# EAGLE design 4-UniverseOut (EAGLE 6.4)
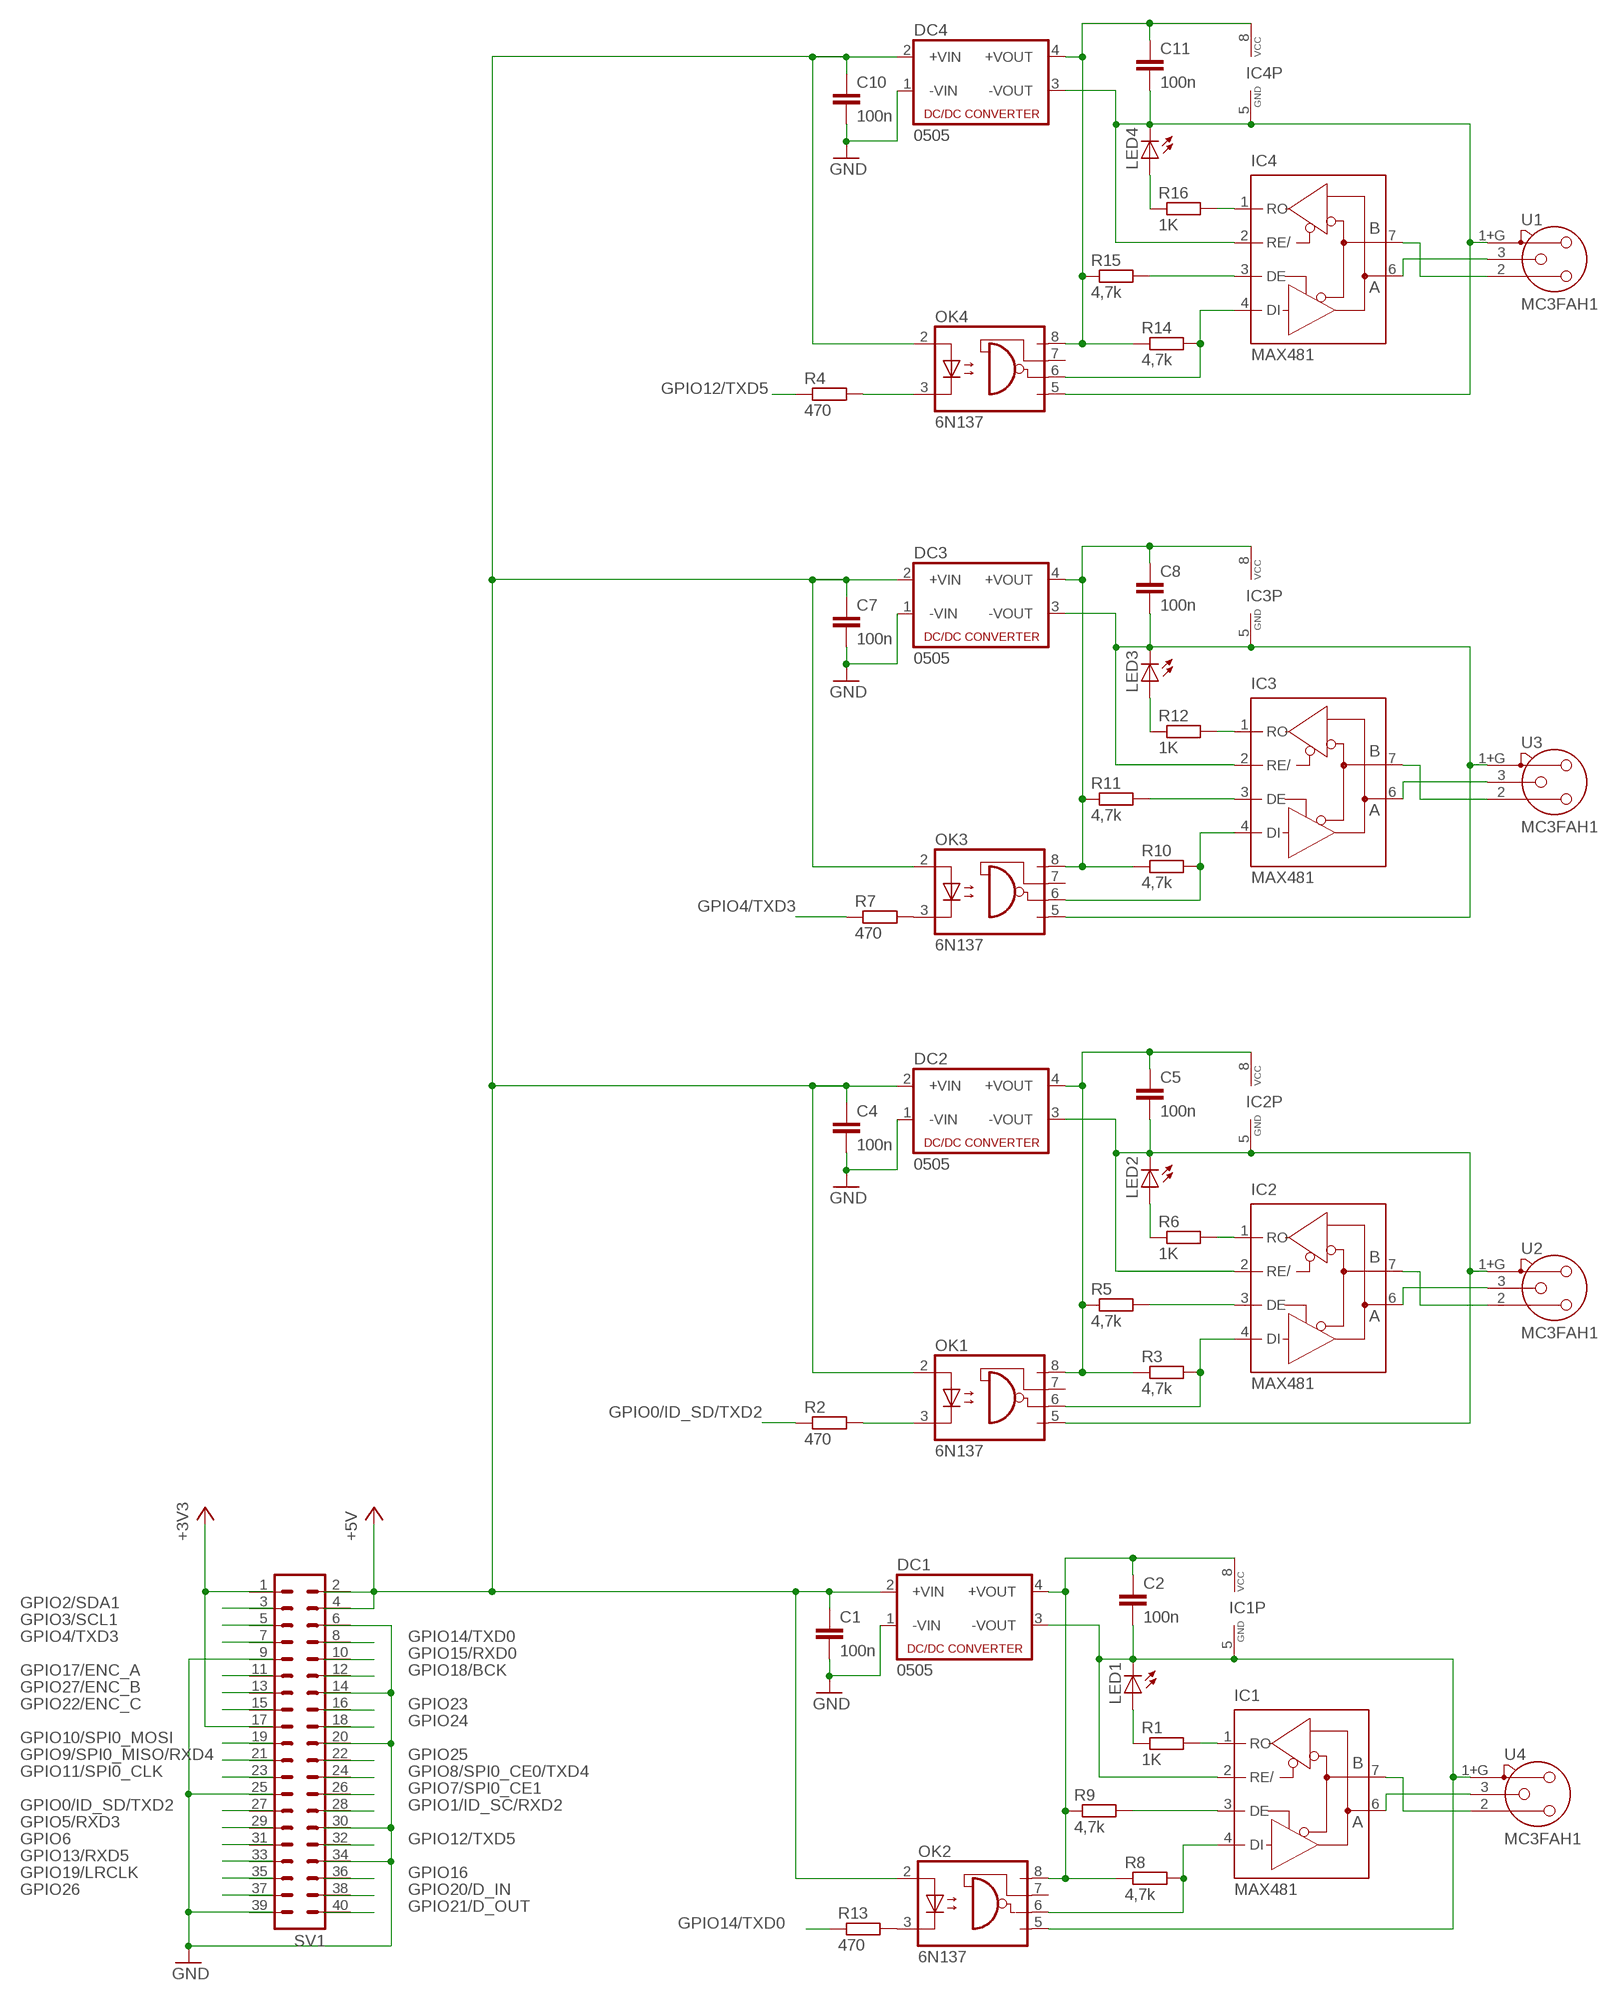
[diagram p0: schematic, sheet 1]

## Parts
C1  100n  C5/3  [C5B3]
C2  100n  C7.5/3  [C7.5B3]
C4  100n  C5/3  [C5B3]
C5  100n  C7.5/3  [C7.5B3]
C7  100n  C5/3  [C5B3]
C8  100n  C7.5/3  [C7.5B3]
C10  100n  C5/3  [C5B3]
C11  100n  C7.5/3  [C7.5B3]
DC1  0505  NME  [NME]
DC2  0505  NME  [NME]
DC3  0505  NME  [NME]
DC4  0505  NME  [NME]
IC1  MAX481  MAX481CPA  [DIL08]
IC2  MAX481  MAX481CPA  [DIL08]
IC3  MAX481  MAX481CPA  [DIL08]
IC4  MAX481  MAX481CPA  [DIL08]
LED1  LED3MM  [LED3MM]
LED2  LED3MM  [LED3MM]
LED3  LED3MM  [LED3MM]
LED4  LED3MM  [LED3MM]
OK1  6N137  [DIL08]
OK2  6N137  [DIL08]
OK3  6N137  [DIL08]
OK4  6N137  [DIL08]
R1  1K  R-EU_0204/7  [0204/7]
R2  470  R-EU_0207/12  [0207/12]
R3  4,7k  R-EU_0204/7  [0204/7]
R4  470  R-EU_0204/7  [0204/7]
R5  4,7k  R-EU_0204/7  [0204/7]
R6  1K  R-EU_0204/7  [0204/7]
R7  470  R-EU_0204/7  [0204/7]
R8  4,7k  R-EU_0204/7  [0204/7]
R9  4,7k  R-EU_0204/7  [0204/7]
R10  4,7k  R-EU_0204/7  [0204/7]
R11  4,7k  R-EU_0204/7  [0204/7]
R12  1K  R-EU_0204/7  [0204/7]
R13  470  R-EU_0204/7  [0204/7]
R14  4,7k  R-EU_0204/7  [0204/7]
R15  4,7k  R-EU_0204/7  [0204/7]
R16  1K  R-EU_0204/7  [0204/7]
SV1  ML40  [ML40]
U1  MC3FAH1  [NC3FAH1]
U2  MC3FAH1  [NC3FAH1]
U3  MC3FAH1  [NC3FAH1]
U4  MC3FAH1  [NC3FAH1]

## Nets
+3V3: SV1.1 SV1.17
+5V: C1.1 C4.1 C7.1 C10.1 DC1.2(+VIN) DC2.2(+VIN) DC3.2(+VIN) DC4.2(+VIN) OK1.2(A) OK2.2(A) OK3.2(A) OK4.2(A) SV1.2 SV1.4
+5V_EXT: C2.1 DC1.4(+VOUT) IC1.8(VCC) OK2.8(VCC) R8.1 R9.1
+5V_EXT1: C5.1 DC2.4(+VOUT) IC2.8(VCC) OK1.8(VCC) R3.1 R5.1
+5V_EXT2: C8.1 DC3.4(+VOUT) IC3.8(VCC) OK3.8(VCC) R10.1 R11.1
+5V_EXT3: C11.1 DC4.4(+VOUT) IC4.8(VCC) OK4.8(VCC) R14.1 R15.1
GND: C1.2 C4.2 C7.2 C10.2 DC1.1(-VIN) DC2.1(-VIN) DC3.1(-VIN) DC4.1(-VIN) SV1.6 SV1.9 SV1.14 SV1.20 SV1.25 SV1.30 SV1.34 SV1.39
GND_EXT: C2.2 DC1.3(-VOUT) IC1.2(RE/) IC1.5(GND) LED1.K(C) OK2.5(GND) U4.1+G
GND_EXT1: C5.2 DC2.3(-VOUT) IC2.2(RE/) IC2.5(GND) LED2.K(C) OK1.5(GND) U2.1+G
GND_EXT2: C8.2 DC3.3(-VOUT) IC3.2(RE/) IC3.5(GND) LED3.K(C) OK3.5(GND) U3.1+G
GND_EXT3: C11.2 DC4.3(-VOUT) IC4.2(RE/) IC4.5(GND) LED4.K(C) OK4.5(GND) U1.1+G
GPIO0/ID_SD/TXD2: R2.1 SV1.27
GPIO1/ID_SC/RXD2: SV1.28
GPIO2/SDA1: SV1.3
GPIO3/SCL1: SV1.5
GPIO4/TXD3: R7.1 SV1.7
GPIO5/RXD3: SV1.29
GPIO6: SV1.31
GPIO7/SPI0_CE1: SV1.26
GPIO8/SPI0_CE0/TXD4: SV1.24
GPIO9/SPI0_MISO/RXD4: SV1.21
GPIO10/SPI0_MOSI: SV1.19
GPIO11/SPI0_CLK: SV1.23
GPIO12/TXD5: R4.1 SV1.32
GPIO13/RXD5: SV1.33
GPIO14/TXD0: R13.1 SV1.8
GPIO15/RXD0: SV1.10
GPIO16: SV1.36
GPIO17/ENC_A: SV1.11
GPIO18/BCK: SV1.12
GPIO19/LRCLK: SV1.35
GPIO20/D_IN: SV1.38
GPIO21/D_OUT: SV1.40
GPIO22/ENC_C: SV1.15
GPIO23: SV1.16
GPIO24: SV1.18
GPIO25: SV1.22
GPIO26: SV1.37
GPIO27/ENC_B: SV1.13
N$1: OK4.3(C) R4.2
N$2: OK3.3(C) R7.2
N$3: OK1.3(C) R2.2
N$4: OK2.3(C) R13.2
N$36: IC1.3(DE) R9.2
N$87: IC1.4(DI) OK2.6(VO) R8.2
N$161: IC1.6(A) U4.3
N$162: IC1.7(B) U4.2
N$164: IC1.1(RO) R1.2
N$165: LED1.A R1.1
N$167: IC2.3(DE) R5.2
N$168: IC2.4(DI) OK1.6(VO) R3.2
N$169: IC2.6(A) U2.3
N$170: IC2.7(B) U2.2
N$172: IC2.1(RO) R6.2
N$173: LED2.A R6.1
N$177: IC3.3(DE) R11.2
N$178: IC3.4(DI) OK3.6(VO) R10.2
N$179: IC3.6(A) U3.3
N$181: IC3.7(B) U3.2
N$187: IC3.1(RO) R12.2
N$188: LED3.A R12.1
N$191: IC4.3(DE) R15.2
N$192: IC4.4(DI) OK4.6(VO) R14.2
N$193: IC4.6(A) U1.3
N$194: IC4.7(B) U1.2
N$196: IC4.1(RO) R16.2
N$197: LED4.A R16.1
Unconnected: OK1.7(VE) OK2.7(VE) OK3.7(VE) OK4.7(VE)

## Library data of the parts
C1 C2 C4 C5 C7 C8 C10 C11 = capacitor-wima:C: CAPACITOR naming: grid - package width
DC1-DC4 = dc-dc-converter:NME: DC-DC CONVERTER; MF: C & D TECHNOLOGIES, INC; MPN: NME1205D; OC_FARNELL: 1021466; OC_NEWARK: 98B8198
IC1-IC4 = maxim:MAX481CPA: RS485 TRANSEIVER; MPN: MAX481CPA+; OC_FARNELL: unknown; OC_NEWARK: 99K3445
LED1-LED4 = led:LED: LED OSRAM: - CHIPLED LG R971, LG N971, LY N971, LG Q971, LY Q971, LO R971, LY R971 LH N974, LH R974 LS Q976, LO Q976, LY Q976 LO Q996 - Hyper CHIPLED LW Q18S LB Q993, LB Q99A, LB R99A - SideLED LS A670, LO A670, LY A670, LG A670, LP A670 LB A673, LV A673, LT A673, LW A673 LH A674 LY A675 LS A676, LA A676, LO A676, LY A676, LW A676 LS A679, LY A679, LG A679 - Hyper Micro SIDELED® LS Y876, LA Y876, LO Y876, LY Y876 LT Y87S - SmartLED LW L88C, LW L88S LB L89C, LB L89S, LG L890 LS L89K, LO L89K, LY L89K LS L896, LA L896, LO L896, LY L896 - TOPLED LS T670, LO T670, LY T670, LG T670, LP T670 LSG T670, LSP T670, LSY T670, LOP T670, LYG T670 LG T671, LOG T671, LSG T671 LB T673, LV T673, LT T673, LW T673 LH T674 LS T676, LA T676, LO T676, LY T676, LB T676, LH T676, LSB T676, LW T676 LB T67C, LV T67C, LT T67C, LS T67K, LO T67K, LY T67K, LW E67C LS E67B, LA E67B, LO E67B, LY E67B, LB E67C, LV E67C, LT E67C LW T67C LS T679, LY T679, LG T679 LS T770, LO T770, LY T770, LG T770, LP T770 LB T773, LV T773, LT T773, LW T773 LH T774 LS E675, LA E675, LY E675, LS T675 LS T776, LA T776, LO T776, LY T776, LB T776 LHGB T686 LT T68C, LB T68C - Hyper Mini TOPLED® LB M676 - Mini TOPLED Santana® LG M470 LS M47K, LO M47K, LY M47K Source: http://www.osram.convergy.de LUXEON: - LUMILED® LXK2-PW12-R00, LXK2-PW12-S00, LXK2-PW14-U00, LXK2-PW14-V00 LXK2-PM12-R00, LXK2-PM12-S00, LXK2-PM14-U00 LXK2-PE12-Q00, LXK2-PE12-R00, LXK2-PE12-S00, LXK2-PE14-T00, LXK2-PE14-U00 LXK2-PB12-K00, LXK2-PB12-L00, LXK2-PB12-M00, LXK2-PB14-N00, LXK2-PB14-P00, LXK2-PB14-Q00 LXK2-PR12-L00, LXK2-PR12-M00, LXK2-PR14-Q00, LXK2-PR14-R00 LXK2-PD12-Q00, LXK2-PD12-R00, LXK2-PD12-S00 LXK2-PH12-R00, LXK2-PH12-S00 LXK2-PL12-P00, LXK2-PL12-Q00, LXK2-PL12-R00 Source: www.luxeon.com KINGBRIGHT: KA-3528ASYC Source: www.kingbright.com
OK1-OK4 = optocoupler:6N137: MOTOROLA OPTO COUPLER; MPN: 6N137; OC_FARNELL: 1328376; OC_NEWARK: 52M1895
R1-R16 = resistor:R-EU_: RESISTOR, European symbol
SV1 = con-ml:ML40: HARTING; OC_FARNELL: unknown; OC_NEWARK: unknown
U1-U4 = con-neutrik_ag:MC3?: Neutrik Audio Connector XLR SERIES Stereo 1/4" jack Source: www.neutrik.com/; OC_FARNELL: unknown; OC_NEWARK: unknown

## Board
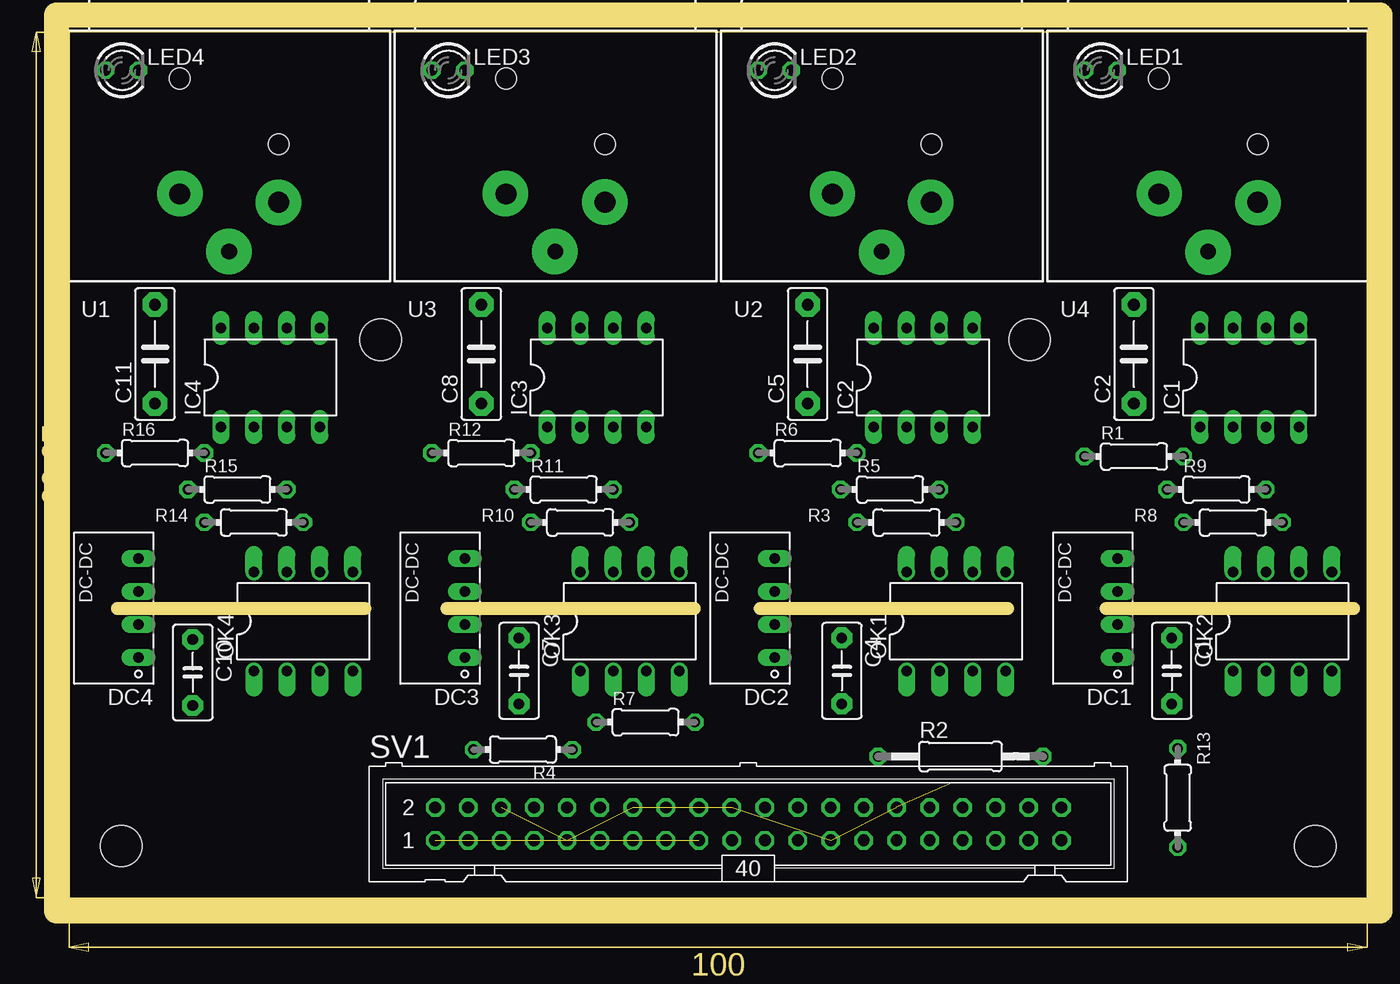
[diagram p1: board, top side]
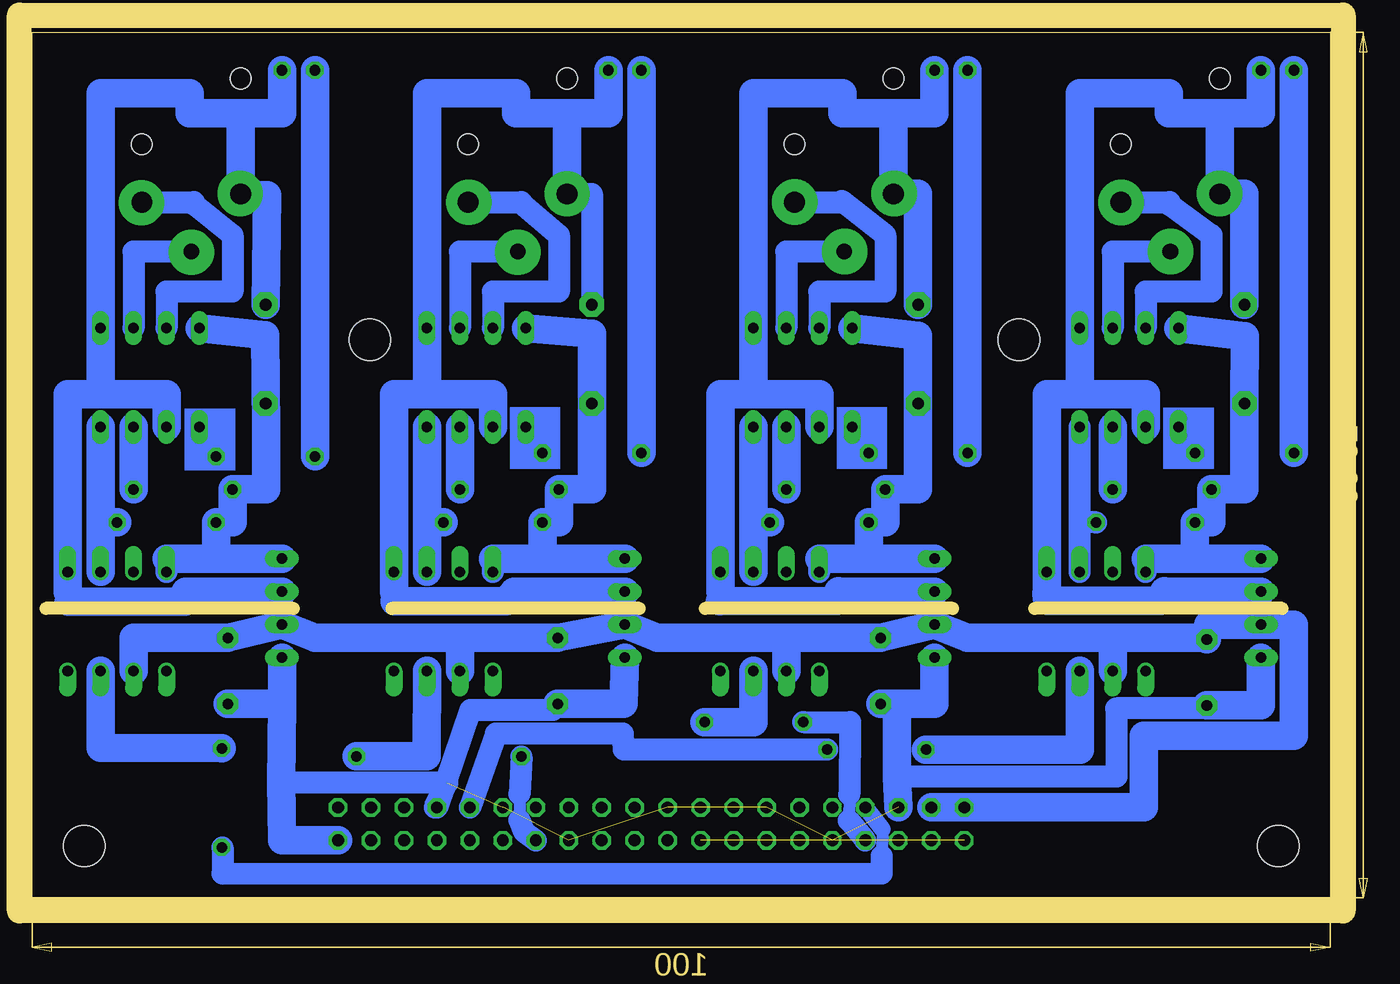
[diagram p2: board, bottom side, seen from below]

Size 100 x 66.67 mm. Coordinates in mm from the lower left corner, seen from the top.
Outline: 0,0 100,0 100,66.67 0,66.67 0,0
Copper layers (1*16): Top 0.035mm / dielectric 1.5mm / Bottom 0.035mm
Design rules "default *": minimum track width 20mil, minimum drill 24mil, track to track 8mil, track to pad 8mil, pad to pad 8mil, via to via 8mil, smd to smd 8mil, copper to edge 40mil, drill to drill 8mil, minimum pad ring 10mil, minimum via ring 8mil, stop-mask expansion 4mil, vias tented up to drill 0mil, thermal gap 10mil
Holes 3.2 mm at 96,4 4,4 74,43 24,43
Milling: 8 lines

### Footprints (pad centres in the part's own frame; a part is rotated, then mirrored left to right if it is on the bottom)
C5B3 = drill 0.813 pad 1.6 octagon: 1 -2.54,0; 2 2.54,0
C7.5B3 = drill 0.914 pad 1.905 octagon: 1 -3.81,0; 2 3.81,0
NME = drill 0.813 long: 1 0,3.81; 2 0,1.27; 3 0,-1.27; 4 0,-3.81
DIL08 = drill 0.813 long: 1 -3.81,-3.81; 2 -1.27,-3.81; 3 1.27,-3.81; 4 3.81,-3.81; 5 3.81,3.81; 6 1.27,3.81; 7 -1.27,3.81; 8 -3.81,3.81
LED3MM = drill 0.813 octagon: A -1.27,0; K 1.27,0
DIL08' = drill 0.813 offset: 1 -3.81,-3.81; 2 -1.27,-3.81; 3 1.27,-3.81; 4 3.81,-3.81; 5 3.81,3.81; 6 1.27,3.81; 7 -1.27,3.81; 8 -3.81,3.81
0204/7 = drill 0.813 octagon: 1 -3.81,0; 2 3.81,0
0207/12 = drill 0.813 octagon: 1 -6.35,0; 2 6.35,0
ML40 = drill 0.914 octagon: 1 -24.13,-1.27; 2 -24.13,1.27; 3 -21.59,-1.27; 4 -21.59,1.27; 5 -19.05,-1.27; 6 -19.05,1.27; 7 -16.51,-1.27; 8 -16.51,1.27; 9 -13.97,-1.27; 10 -13.97,1.27; 11 -11.43,-1.27; 12 -11.43,1.27; 13 -8.89,-1.27; 14 -8.89,1.27; 15 -6.35,-1.27; 16 -6.35,1.27; 17 -3.81,-1.27; 18 -3.81,1.27; 19 -1.27,-1.27; 20 -1.27,1.27; 21 1.27,-1.27; 22 1.27,1.27; 23 3.81,-1.27; 24 3.81,1.27; 25 6.35,-1.27; 26 6.35,1.27; 27 8.89,-1.27; 28 8.89,1.27; 29 11.43,-1.27; 30 11.43,1.27; 31 13.97,-1.27; 32 13.97,1.27; 33 16.51,-1.27; 34 16.51,1.27; 35 19.05,-1.27; 36 19.05,1.27; 37 21.59,-1.27; 38 21.59,1.27; 39 24.13,-1.27; 40 24.13,1.27
NC3FAH1 = drill 1.6: 1+G -3.81,0.635; 2 3.81,0 | drill 1.2: 3 0,-3.815 | hole 1.6: -3.81,9.525; 3.81,4.445

### Placement (x,y rotation side)
C1  84.95,17.49 270 top
C2  82.04,41.89 90 top
C4  59.53,17.49 270 top
C5  56.9,41.89 90 top
C7  34.66,17.49 270 top
C8  31.75,41.89 90 top
C10  9.51,17.37 270 top
C11  6.6,41.89 90 top
DC1  80.77,22.32 180 top
DC2  54.36,22.32 180 top
DC3  30.48,22.32 180 top
DC4  5.33,22.32 180 top
IC1  90.93,40.08 0 top
IC2  65.79,40.08 0 top
IC3  40.64,40.08 0 top
IC4  15.49,40.08 0 top
LED1  79.5,63.75 0 top
LED2  54.36,63.75 0 top
LED3  29.21,63.75 0 top
LED4  4.06,63.75 0 top
OK1  6N137  [DIL08']  68.33,21.3 0 top
OK2  6N137  [DIL08']  93.47,21.3 0 top
OK3  6N137  [DIL08']  43.18,21.3 0 top
OK4  6N137  [DIL08']  18.03,21.3 0 top
R1  82.04,34 0 top
R2  68.67,10.89 0 top
R3  64.52,28.92 0 top
R4  34.95,11.43 180 top
R5  63.25,31.46 0 top
R6  56.9,34.27 0 top
R7  44.4,13.54 0 top
R8  89.66,28.92 0 top
R9  88.39,31.46 0 top
R10  39.37,28.92 0 top
R11  38.1,31.46 0 top
R12  31.75,34.27 0 top
R13  85.41,7.71 90 top
R14  14.22,28.92 0 top
R15  12.95,31.46 0 top
R16  6.6,34.27 0 top
SV1  52.32,5.7 0 top
U1  12.32,53.59 0 top
U2  62.61,53.59 0 top
U3  37.47,53.59 0 top
U4  87.76,53.59 0 top

### Tracks (layer width: path | path; a pad name or v marks a point on that pad's centre or on a via)
+3V3  (1 unrouted)
+5V
  Bottom 1.676: 9.78,20.03 C10.1
  Bottom 2.184: OK2.2 92.2,20.03 C1.1 DC1.2 78.23,20.03 67.06,20.03 | 67.06,20.03 C4.1 DC2.2 51.82,20.03 41.91,20.03 | 67.06,20.03 OK1.2 | 41.91,20.03 C7.1 DC3.2 27.94,20.03 16.76,20.03 | 41.91,20.03 OK3.2 | C10.1 9.4,21.05 DC4.2 2.79,21.05 2.79,12.49 14.34,12.49 14.34,6.97 SV1.2 SV1.4 | OK4.2 16.76,20.03 | 16.76,20.03 9.78,20.03
+5V_EXT
  Bottom 1.676: OK2.8 89.66,26.13 | C2.1 82,36.08
  Bottom 2.184: 89.66,26.13 85.85,26.13 | 85.85,26.13 R8.1 84.58,28.92 R9.1 82,31.46 82,36.08 82.05,43.34 IC1.8 | DC1.4 85.85,26.13
+5V_EXT1
  Bottom 1.676: OK1.8 64.52,26.13
  Bottom 2.184: IC2.8 56.9,43.48 C5.1 56.9,31.46 R5.1 59.44,28.92 R3.1 60.71,26.13 | 60.71,26.13 DC2.4 | 60.71,26.13 64.52,26.13
+5V_EXT2
  Bottom 1.676: OK3.8 39.37,26.13 | R10.1 34.29,28.92
  Bottom 2.184: DC3.4 35.56,26.13 | 39.37,26.13 35.56,26.13 | 35.56,26.13 R10.1 | 34.29,28.92 R11.1 31.75,31.46 C8.1 31.75,43.3 IC3.8
+5V_EXT3
  Bottom 1.676: OK4.8 14.22,26.13
  Bottom 2.184: IC4.8 6.56,43.28 C11.1 6.6,31.46 R15.1 9.14,28.92 R14.1 10.41,26.13 | DC4.4 10.41,26.13 | 14.22,26.13 10.41,26.13
GND  (6 unrouted)
  Bottom 1.27: SV1.34 69,6.97
  Bottom 1.676: C10.2 8.51,14.7 9.38,14.7 9.37,14.61 16.48,14.61 16.47,9.35 33.37,9.35 | C4.2 59.92,14.47 66.26,14.47 SV1.34 | 69,6.97 68.05,8.86 80.82,8.86
  Bottom 2.184: DC3.1 30.48,14.95 33.4,14.95 | 33.4,14.95 33.37,9.35 SV1.6 | C10.2 5.33,14.83 DC4.1 | 33.4,14.95 C7.2 | DC2.1 54.45,14.95 C4.2 | SV1.39 80.77,4.43 80.82,8.86 80.77,14.95 | C1.2 80.77,14.95 | 80.77,14.95 DC1.1
GND_EXT
  Bottom 1.676: IC1.5 94.74,43.96 | 97.2,22.83 97.2,23.57 97.28,23.59
  Bottom 2.184: 94.74,43.96 94.74,61.98 87.88,61.98 87.88,60.45 83.95,60.45 | 83.95,60.45 U4.1+G 81.92,54.12 C2.2 | IC1.2 89.66,38.81 94.74,38.81 | 94.74,38.81 IC1.5 | 94.74,38.81 97.28,38.81 OK2.5 97.28,23.59 | DC1.3 88.2,23.59 88.26,22.83 97.2,22.83 | 83.95,60.45 80.77,60.45 LED1.K
GND_EXT1
  Bottom 1.676: U2.1+G 56.9,54.23 C5.2 | 72.08,22.85 72.13,23.47 72.14,23.59
  Bottom 2.184: 58.8,60.45 62.74,60.45 62.74,61.98 69.6,61.98 IC2.5 69.6,38.81 | 58.8,60.45 U2.1+G | 72.14,23.59 OK1.5 72.14,38.81 69.6,38.81 | 69.6,38.81 64.52,38.81 IC2.2 | DC2.3 62.91,23.59 63.51,22.84 72.08,22.85 | 58.8,60.45 55.63,60.45 LED2.K
GND_EXT2
  Bottom 1.676: 47.03,22.86 46.96,23.67 46.97,23.67 46.97,23.68 46.99,23.59
  Bottom 2.184: 46.99,23.59 OK3.5 46.99,38.81 44.45,38.81 | 44.45,38.81 IC3.5 44.45,61.98 37.59,61.98 37.59,60.45 33.66,60.45 | 33.66,60.45 U3.1+G 31.75,54.23 C8.2 | DC3.3 37.9,23.61 37.97,22.88 47.03,22.86 | IC3.2 39.37,38.81 44.45,38.81 | 33.66,60.45 30.48,60.45 LED3.K
GND_EXT3  (via drill 0.6 pad 3.5)
  Bottom 1.676: v8.51,54.25 U1.1+G | 21.85,23.47 21.84,23.59
  Bottom 2.184: 8.51,60.45 12.45,60.45 12.45,61.98 19.3,61.98 IC4.5 19.3,38.81 | 8.51,60.45 v8.51,54.25 | 19.3,38.81 14.22,38.81 IC4.2 | 19.3,38.81 21.84,38.81 OK4.5 21.84,23.59 | DC4.3 12.79,23.61 13.06,22.9 21.8,22.9 21.85,23.47 | C11.2 6.6,54.23 U1.1+G | 8.51,60.45 5.33,60.45 LED4.K
GPIO0/ID_SD/TXD2
  Bottom 0.94: 62.47,7.99 62.47,5.99
  Bottom 1.676: R2.1 62.47,7.99 | 62.47,5.99 62.1,5.08 SV1.27
GPIO4/TXD3
  Bottom 0.813: 37.1,5.98 37,6 36.62,5.62 37.1,5.98
  Bottom 0.94: 37.06,7.97 37.1,5.98
  Bottom 1.676: R7.1 37,13.54 37.06,7.97 | 37.1,5.98 SV1.7
GPIO12/TXD5
  Bottom 1.676: R4.1 54.43,11.43 54.51,12.65 64.28,12.65 SV1.32
GPIO14/TXD0
  Bottom 0.813: R13.1 85.34,3.9 | 34.54,3.23 34.49,3.26 | 34.48,5.32 34.51,5.28
  Bottom 0.94: 34.49,3.26 34.48,5.32
  Bottom 1.27: 34.51,5.28 SV1.8
  Bottom 1.676: 85.34,3.9 85.36,1.88 34.56,1.88 34.54,3.23
N$1
  Bottom 2.184: R4.2 19.3,11.41 OK4.3
N$2
  Bottom 2.184: R7.2 44.45,13.54 OK3.3
N$3
  Bottom 2.184: R2.2 69.62,10.89 OK1.3
N$4
  Bottom 2.184: R13.2 94.74,11.59 OK2.3
N$5  (via drill 0.6 pad 3.5)
  other vias: 12.29,49.79
N$6  (via drill 0.6 pad 3.5)
  other vias: 16.1,53.57
N$7  (via drill 0.6 pad 3.5)
  other vias: 37.42,49.79
N$8  (via drill 0.6 pad 3.5)
  other vias: 58.81,54.24
N$9  (via drill 0.6 pad 3.5)
  other vias: 66.39,53.58
N$10  (via drill 0.6 pad 3.5)
  other vias: 62.59,49.74
N$11  (via drill 0.6 pad 3.5)
  other vias: 84,54.24
N$12  (via drill 0.6 pad 3.5)
  other vias: 91.61,53.55
N$13  (via drill 0.6 pad 3.5)
  other vias: 87.75,49.74
N$14  (via drill 0.6 pad 3.5)
  other vias: 33.61,54.25
N$15  (via drill 0.6 pad 3.5)
  other vias: 41.27,53.59
N$36
  Bottom 2.184: R9.2 IC1.3
N$87
  Bottom 2.184: 94.74,28.92 IC1.4 | OK2.6 94.74,28.92 | 94.74,28.92 R8.2
N$161
  Bottom 1.676: U4.3 92.2,49.78 IC1.6
N$162
  Bottom 1.676: U4.2 87.55,53.59 87.55,53.43 84.58,51.05 84.58,46.7 89.66,46.7 IC1.7
N$164
  Bottom 1.676: R1.2 87.12,34 IC1.1
N$165
  Bottom 2.184: LED1.A R1.1
N$167
  Bottom 2.184: R5.2 IC2.3
N$168
  Bottom 2.184: 69.6,28.92 OK1.6 | R3.2 69.6,28.92 | 69.6,28.92 IC2.4
N$169
  Bottom 1.676: U2.3 67.06,49.78 IC2.6
N$170
  Bottom 1.676: U2.2 62.33,53.59 62.33,53.51 59.44,51.05 59.44,46.7 64.52,46.7 IC2.7
N$172
  Bottom 1.676: IC2.1 61.98,34.29 R6.2
N$173
  Bottom 2.184: LED2.A R6.1
N$177
  Bottom 2.184: R11.2 IC3.3
N$178
  Bottom 2.184: 44.45,28.92 IC3.4 | R10.2 44.45,28.92 | 44.45,28.92 OK3.6
N$179
  Bottom 1.676: U3.3 41.91,49.78 IC3.6
N$181
  Bottom 1.676: U3.2 37.65,53.59 37.65,53.7 34.29,51.05 34.29,46.7 39.37,46.7 IC3.7
N$187
  Bottom 1.676: IC3.1 36.91,34.53 36.56,34.27 R12.2
N$188
  Bottom 2.184: LED3.A R12.1
N$191
  Bottom 2.184: IC4.3 R15.2
N$192
  Bottom 1.676: OK4.6 19.3,28.92 | R14.2 19.3,28.92 | 19.3,28.92 IC4.4
N$193
  Bottom 1.676: U1.3 16.76,49.78 IC4.6
N$194
  Bottom 1.676: U1.2 12.36,53.59 12.36,53.38 9.14,51.05 9.14,46.7 14.22,46.7 IC4.7
N$196
  Bottom 1.676: R16.2 11.43,34.29 11.68,34.54 IC4.1
N$197
  Bottom 2.184: LED4.A R16.1
(copper drawn outside any net)
  shapes: Bottom area x4